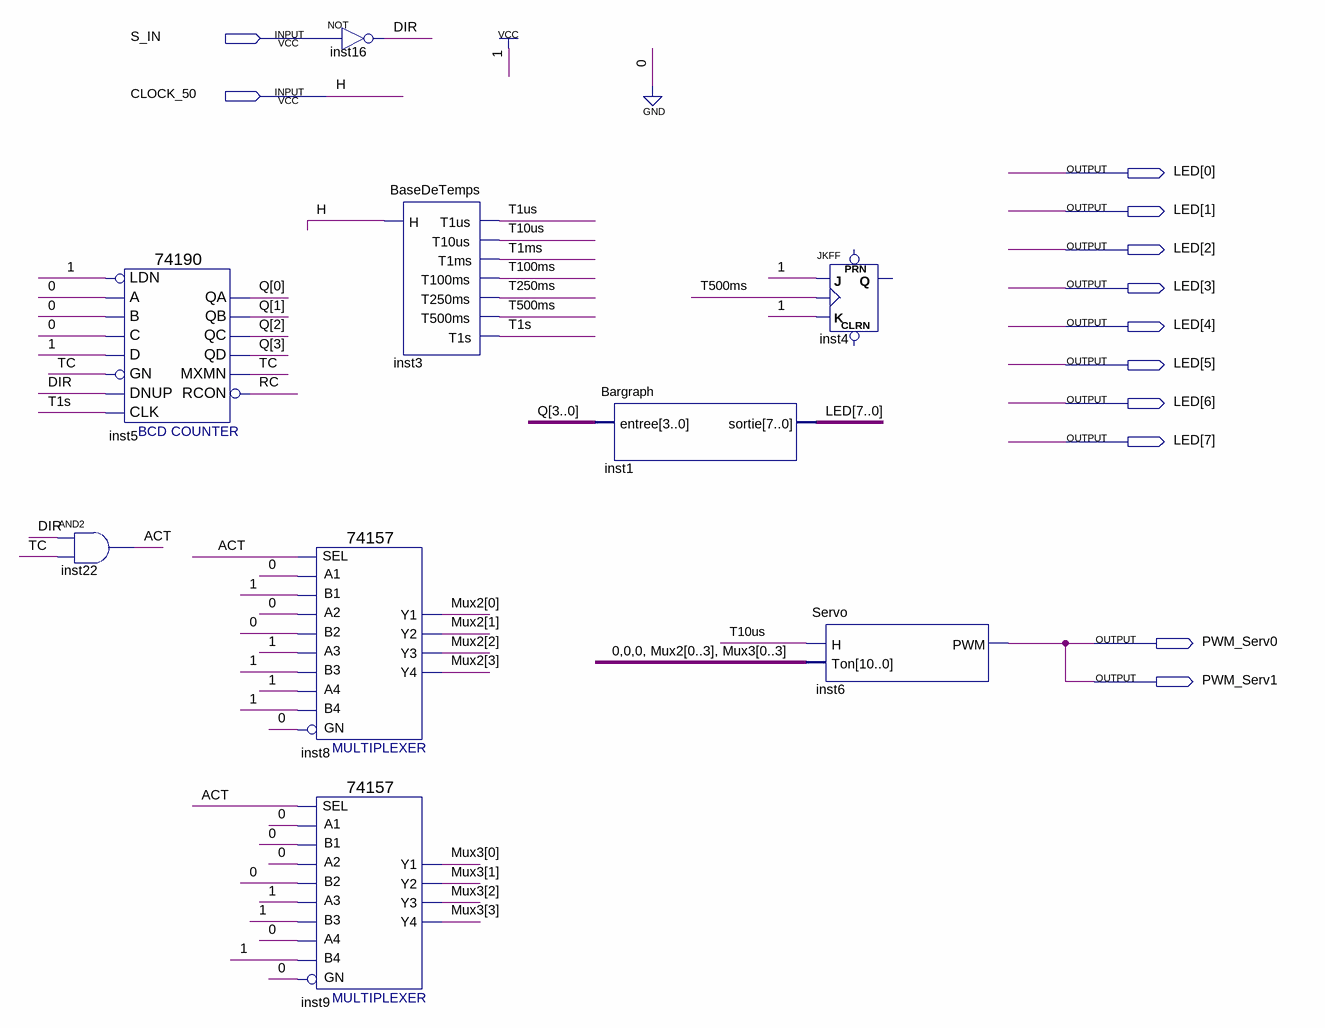
[diagram p0: schematic sheet]
// Quartus schematic TopUselessBox.bdf as structural Verilog: 9 symbols, 12 pins
module TopUselessBox (
  input  S_IN,
  input  CLOCK_50,
  output [7:0] LED,
  output PWM_Serv0,
  output PWM_Serv1
);

  wire ACT, DIR, RC, T1ms, T1s, T1us, T10us, T100ms, T250ms, T500ms, TC;
  wire [3:0] Mux2, Mux3, Q;

  and inst22 (ACT, DIR, TC);
  \74190  inst5 (
    .LDN(1'b1), .A(1'b0), .C(1'b0), .B(1'b0), .D(1'b1), .GN(TC), .CLK(T1s), .DNUP(DIR), .QA(Q[0]), .QB(Q[1]),
    .QD(Q[3]), .QC(Q[2]), .MXMN(TC), .RCON(RC));
  \74157  inst8 (
    .A1(1'b0), .B1(1'b1), .SEL(ACT), .B2(1'b0), .A3(1'b1), .B3(1'b1), .A2(1'b0), .B4(1'b1), .GN(1'b0),
    .A4(1'b1), .Y2(Mux2[1]), .Y1(Mux2[0]), .Y4(Mux2[3]), .Y3(Mux2[2]));
  \74157  inst9 (
    .A1(1'b0), .B1(1'b0), .SEL(ACT), .B2(1'b0), .A3(1'b1), .B3(1'b1), .A2(1'b0), .B4(1'b1), .GN(1'b0),
    .A4(1'b0), .Y2(Mux3[1]), .Y1(Mux3[0]), .Y4(Mux3[3]), .Y3(Mux3[2]));
  not inst16 (DIR, S_IN);
  BaseDeTemps inst3 (
    .H(CLOCK_50), .T1us(T1us), .T10us(T10us), .T100ms(T100ms), .T250ms(T250ms), .T500ms(T500ms), .T1ms(T1ms),
    .T1s(T1s));
  Bargraph inst1 (.entree(Q), .sortie(LED));
  JKFF inst4 (.K(1'b1), .J(1'b1), .CLK(T500ms));  // open: PRN, CLRN, Q
  Servo inst6 (
    .H(T10us), .Ton({3'b000, Mux2[0], Mux2[1], Mux2[2], Mux2[3], Mux3[0], Mux3[1], Mux3[2], Mux3[3]}),
    .PWM(PWM_Serv0));

  assign PWM_Serv1 = PWM_Serv0;

  // Other names for the same wires on the sheet: H = CLOCK_50
endmodule
